# EAGLE design LED_Ver.1 (EAGLE 6.6.0)
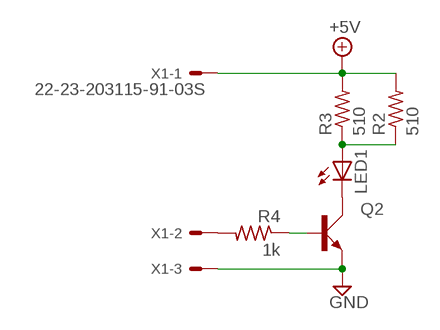
[diagram p0: schematic, sheet 1]

## Parts
LED1  LED3528  [KA-3528ASYC]
Q2  2SC2712  2SC1815SOT  [SOT23]
R2  510  R-US_R1608  [R1608]
R3  510  R-US_R1608  [R1608]
R4  1k  R-US_R1608  [R1608]
X1  22-23-203115-91-03S  [15-91-03S]

## Nets
+5V: R2.2 R3.2 X1.1
GND: Q2.2(E) X1.3
N$1: LED1.C Q2.3(C)
N$2: LED1.A R2.1 R3.1
N$3: R4.2 X1.2
N$4: Q2.1(B) R4.1

## Library data of the parts
LED1 = LED:LED: LED OSRAM: - CHIPLED LG R971, LG N971, LY N971, LG Q971, LY Q971, LO R971, LY R971 LH N974, LH R974 LS Q976, LO Q976, LY Q976 LO Q996 - Hyper CHIPLED LW Q18S LB Q993, LB Q99A, LB R99A - SideLED LS A670, LO A670, LY A670, LG A670, LP A670 LB A673, LV A673, LT A673, LW A673 LH A674 LY A675 LS A676, LA A676, LO A676, LY A676, LW A676 LS A679, LY A679, LG A679 - Hyper Micro SIDELED® LS Y876, LA Y876, LO Y876, LY Y876 LT Y87S - SmartLED LW L88C, LW L88S LB L89C, LB L89S, LG L890 LS L89K, LO L89K, LY L89K LS L896, LA L896, LO L896, LY L896 - TOPLED LS T670, LO T670, LY T670, LG T670, LP T670 LSG T670, LSP T670, LSY T670, LOP T670, LYG T670 LG T671, LOG T671, LSG T671 LB T673, LV T673, LT T673, LW T673 LH T674 LS T676, LA T676, LO T676, LY T676, LB T676, LH T676, LSB T676, LW T676 LB T67C, LV T67C, LT T67C, LS T67K, LO T67K, LY T67K, LW E67C LS E67B, LA E67B, LO E67B, LY E67B, LB E67C, LV E67C, LT E67C LW T67C LS T679, LY T679, LG T679 LS T770, LO T770, LY T770, LG T770, LP T770 LB T773, LV T773, LT T773, LW T773 LH T774 LS E675, LA E675, LY E675, LS T675 LS T776, LA T776, LO T776, LY T776, LB T776 LHGB T686 LT T68C, LB T68C - Hyper Mini TOPLED® LB M676 - Mini TOPLED Santana® LG M470 LS M47K, LO M47K, LY M47K Source: http://www.osram.convergy.de/
Q2 = Transistor_NPN:2SC1815: NPN TRANSISTOR
R2-R4 = Registor:R-US_: RESISTOR, American symbol
X1 = Con-molex:22-23-2031: .100" (2.54mm) Center Header - 3 Pin

## Board
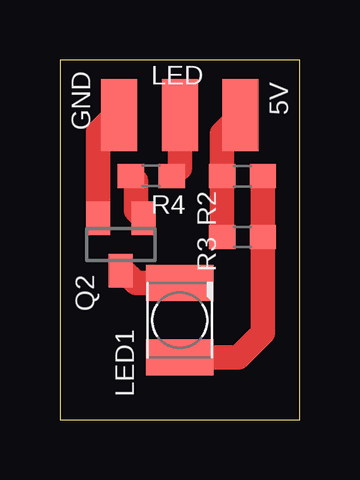
[diagram p1: board, top side]

Size 10 x 15 mm. Coordinates in mm from the lower left corner, seen from the top.
Outline: 0,0 10,0 10,15 0,15 0,0
Copper layers (1*16): Top 0.035mm / dielectric 1.5mm / Bottom 0.035mm
Design rules "SeeedStudio_2layer_DRU_no_angle_20140221a": minimum track width 6mil, minimum drill 12mil, track to track 6mil, track to pad 6mil, pad to pad 6mil, via to via 6mil, smd to smd 0mil, copper to edge 10mil, drill to drill 10mil, minimum pad ring 10mil, minimum via ring 6mil, stop-mask expansion 2mil, vias tented up to drill 25mil, thermal gap 10mil

### Footprints (pad centres in the part's own frame; a part is rotated, then mirrored left to right if it is on the bottom)
KA-3528ASYC = smd 1.5 x 2.8: A -1.55,0; C 1.55,0
SOT23 = smd 1 x 1.4: 1 -0.95,-1.1; 2 0.95,-1.1; 3 0,1.1
R1608 = smd 1.1 x 1: 1 -0.85,0; 2 0.85,0
15-91-03S = smd 1.5 x 3: 1 -2.54,-0.635; 2 0,-0.635; 3 2.54,-0.635

### Placement (x,y rotation side)
LED1  5,4.14 90 top
Q2  2.54,7.3 180 top
R2  7.62,10.16 180 top
R3  7.62,7.62 180 top
R4  3.81,10.16 0 top
X1  5,12.06 180 top

### Tracks (layer width: path | path; a pad name or v marks a point on that pad's centre or on a via)
+5V
  Top 1.016: R3.2 R2.2 6.77,11.93 X1.1
GND
  Top 1.016: X1.3 2.3,12.7 1.59,11.99 Q2.2
N$1
  Top 1.016: LED1.C 3.17,5.69 2.54,6.33 Q2.3
N$2
  Top 1.016: R2.1 R3.1 8.47,3.62 7.44,2.59 LED1.A
N$3
  Top 1.016: R4.2 5,10.5 X1.2
N$4
  Top 1.016: R4.1 3.17,9.95 3.17,8.72 Q2.1

### Text on the board
tNames: LED | 5V | GND